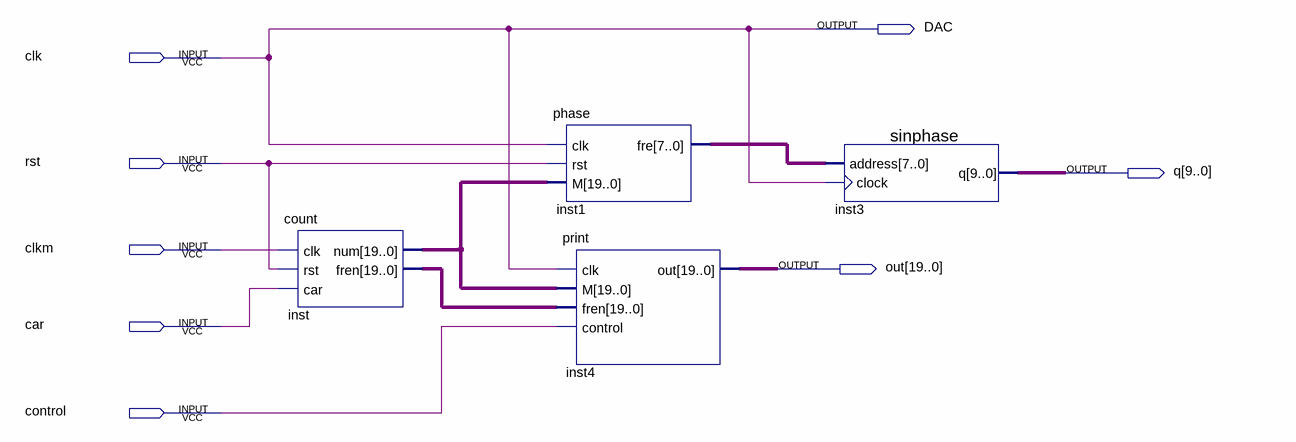
[diagram p0: schematic sheet]
// Quartus schematic demo.bdf as structural Verilog: 4 symbols, 8 pins
module demo (
  input  clk,
  input  rst,
  input  clkm,
  input  car,
  input  control,
  output DAC,
  output [9:0] q,
  output [19:0] out
);

  wire [7:0] inst1_fre;
  wire [19:0] inst_fren, inst_num;

  count inst (.clk(clkm), .rst(rst), .car(car), .num(inst_num), .fren(inst_fren));
  phase inst1 (.clk(clk), .rst(rst), .M(inst_num), .fre(inst1_fre));
  print inst4 (.clk(clk), .M(inst_num), .fren(inst_fren), .control(control), .out(out));
  sinphase inst3 (.address(inst1_fre), .clock(clk), .q(q));

  assign DAC = clk;
endmodule
